# Altium schematic sheet ArrayBoardTop.SchDoc
size A4; SheetNumber: 1; SheetTotal: 3
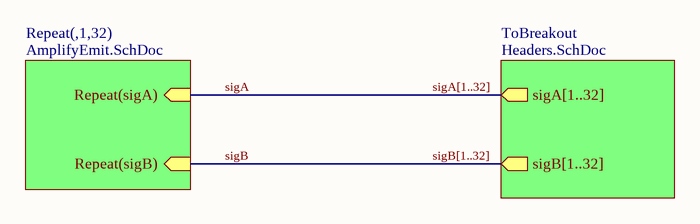
[diagram p0: ArrayBoardTop.SchDoc]

## Sub-sheets
Repeat(,1,32) = AmplifyEmit.SchDoc: Repeat(sigB) (in), Repeat(sigA) (in)
ToBreakout = Headers.SchDoc: sigB[1..32] (out), sigA[1..32] (out)

## Nets
sigA: sheet Repeat(,1,32)/Repeat(sigA)
sigB: sheet Repeat(,1,32)/Repeat(sigB)

## Buses and harness runs
bus sigA[1..32] = sheet ToBreakout/sigA[1..32]
bus sigB[1..32] = sheet ToBreakout/sigB[1..32]